# EAGLE design Platypus_v1_0_Proto_v14_0 (EAGLE 7.5.0)
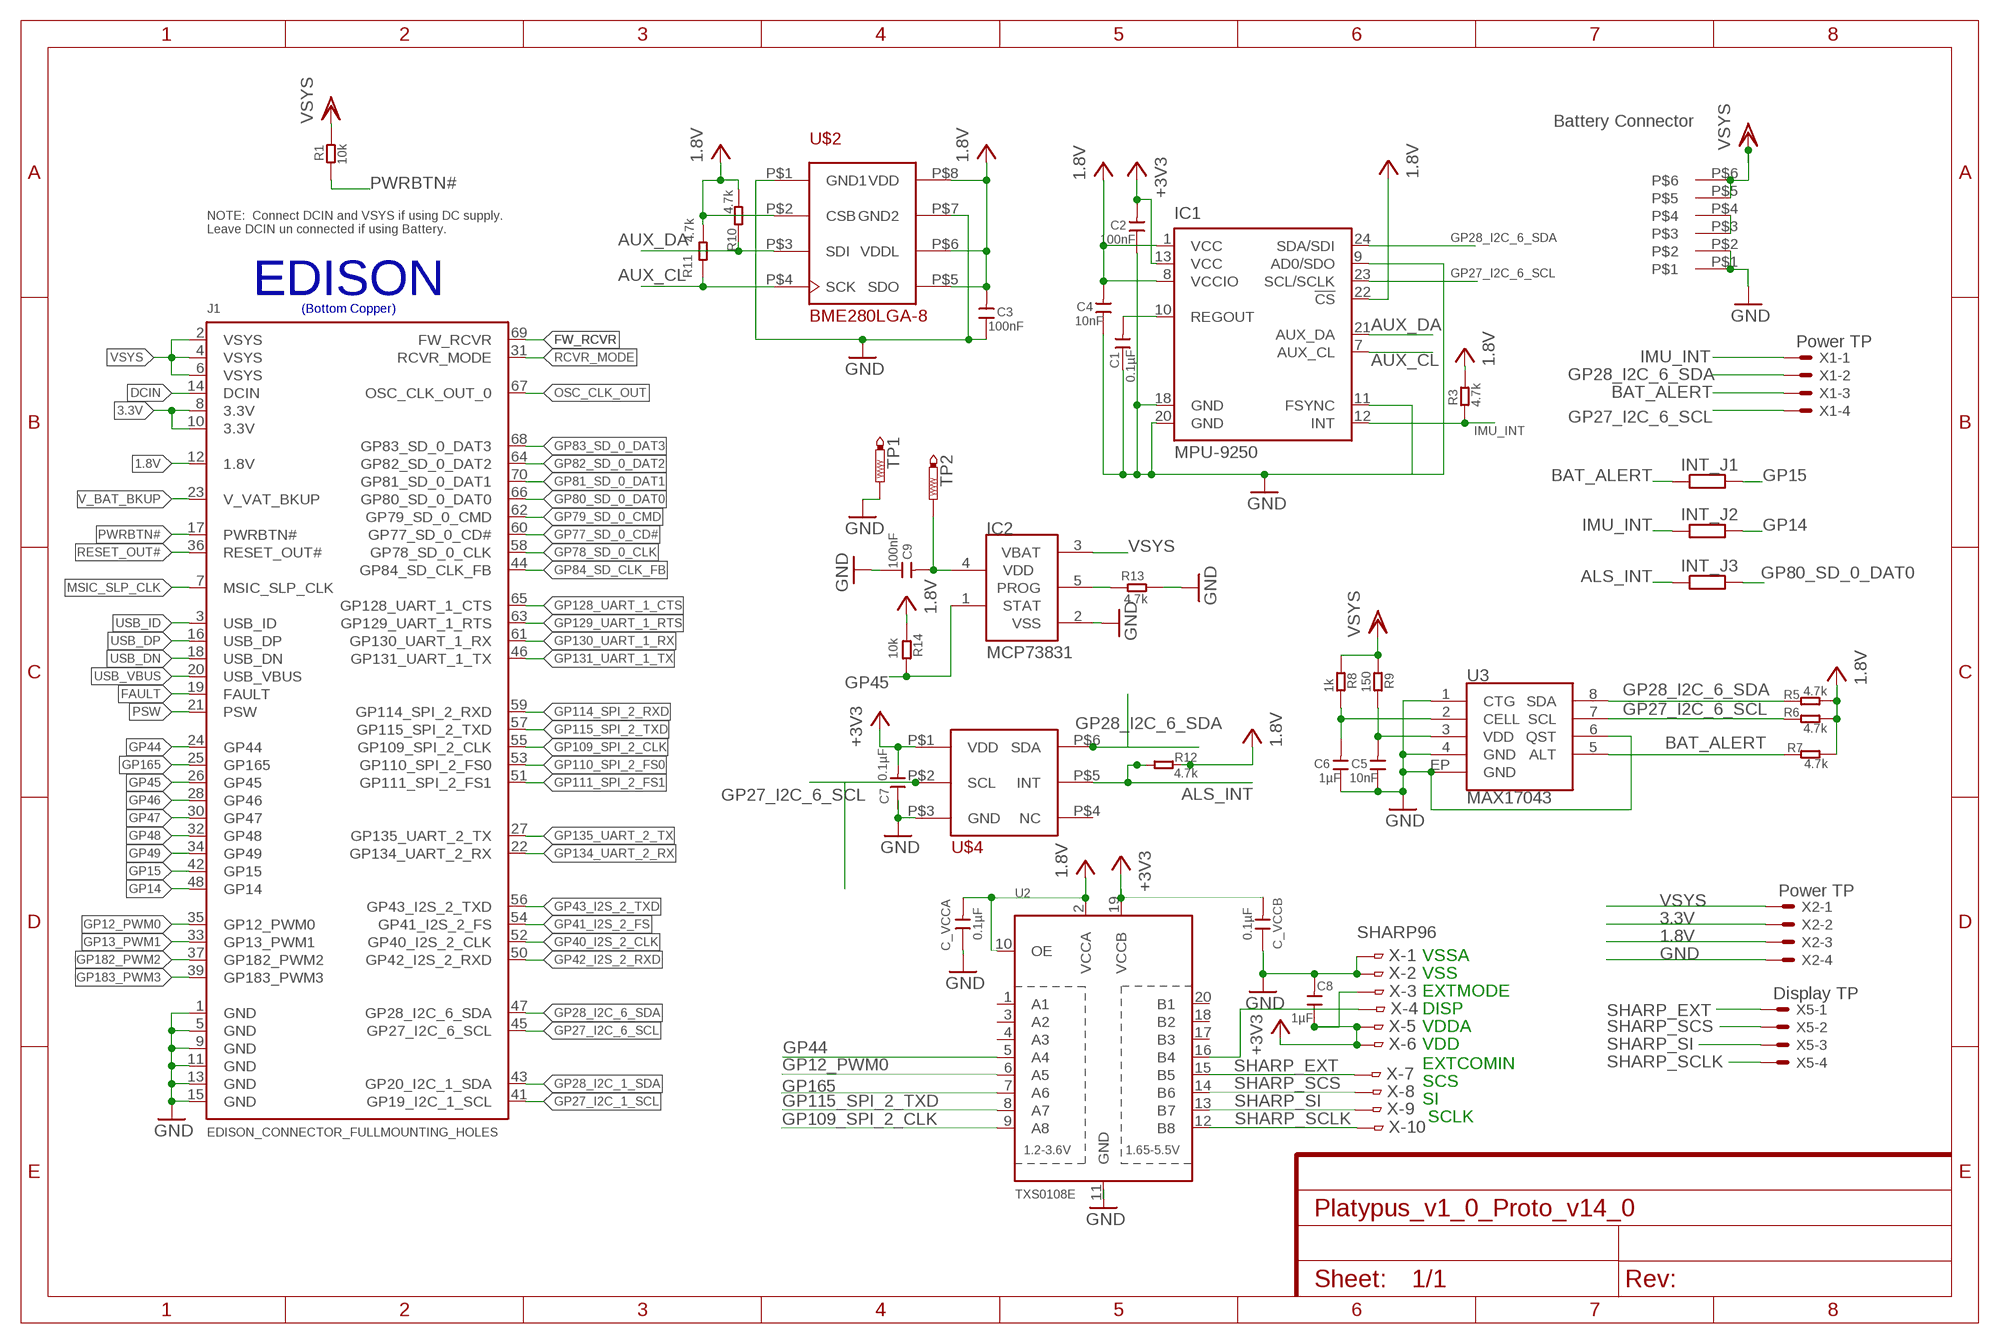
[diagram p0: schematic, sheet 1]

## Parts
C1  0.1µF  C-0603  [C0603]
C2  100nF  C-0603  [C0603]
C3  100nF  C-0603  [C0603]
C4  10nF  C-0603  [C0603]
C5  10nF  C-0603  [C0603]
C6  1µF  C-0603  [C0603]
C7  0.1µF  C-0603  [C0603]
C8  1µF  C-0603  [C0603]
C9  100nF  C-0603  [C0603]
C_VCCA  0.1µF  C-0603  [C0603]
C_VCCB  0.1µF  C-0603  [C0603]
IC1  MPU-9250  [QFN24-SMALL]
IC2  MCP73831  [SOT23-5L]
INT_J1  R-EU_R0201  [R0201]
INT_J2  R-EU_R0201  [R0201]
INT_J3  R-EU_R0201  [R0201]
J1  EDISON_CONNECTOR_FULLMOUNTING_HOLES  [EDISON_DAUGHTER]
R1  10k  R-0603  [R0603]
R3  4.7k  R-0603  [R0603]
R5  4.7k  R-0603  [R0603]
R6  4.7k  R-0603  [R0603]
R7  4.7k  R-0603  [R0603]
R8  1k  R-0603  [R0603]
R9  150  R-0603  [R0603]
R10  4.7k  R-0603  [R0603]
R11  4.7k  R-0603  [R0603]
R12  4.7k  R-0603  [R0603]
R13  4.7k  R-0603  [R0603]
R14  10k  R-0603  [R0603]
TP1  PTR1TP19SQ  [TP19SQ]
TP2  PTR1TP19SQ  [TP19SQ]
U2  TXS0108E  TXB0108PWR  [TSSOP20]
U3  MAX17043  MAX1704X  [TDFN-8]
U$2  BME280LGA-8  [LGA-8]
U$3  HIROSE_BAT_CON  [0.5MM-PITCH,6-PIN]
U$4  TSL25723FNFN-6PIN  [FN-6PIN]
X  SHARP96  FH12-10S-0.5SH  [FH12-10S-0.5SH]
X1  Power TP  53047-04  [53047-04]
X2  Power TP  53047-04  [53047-04]
X5  Display TP  53047-04  [53047-04]

## Nets
1.8V: C3.2 C4.2 C_VCCA.2 IC1.1(VCC) IC1.8(VCCIO) IC1.22(!CS) J1.12(1.8V) R3.2 R5.2 R6.2 R7.1 R10.2 R11.2 R12.2 R14.2 U2.2(VCCA) U2.10(OE) U$2.P$2(CSB) U$2.P$5(SDO) U$2.P$6(VDDL) U$2.P$8(VDD) X2.3
3.3V: C2.2 C7.2 C8.1 C_VCCB.2 IC1.13(VCC) J1.8(3.3V) J1.10(3.3V) U2.19(VCCB) U$4.P$1(VDD) X2.2 X.3 X.5 X.6 ; supply symbol labelled +3V3
ALS_INT: INT_J3.1 R12.1 U$4.P$5(INT)
AUX_CL: IC1.7(AUX_CL) R11.1 U$2.P$4(SCK)
AUX_DA: IC1.21(AUX_DA) R10.1 U$2.P$3(SDI)
BAT_ALERT: INT_J1.1 R7.2 U3.5(ALT) X1.3
DCIN: J1.14(DCIN)
FAULT: J1.19(FAULT)
FW_RCVR: J1.69(FW_RCVR)
GND: C1.1 C2.1 C3.1 C4.1 C5.1 C6.1 C7.1 C8.2 C9.1 C_VCCA.1 C_VCCB.1 IC1.9(AD0/SDO) IC1.11(FSYNC) IC1.18(GND) IC1.20(GND) IC2.2(VSS) J1.1(GND) J1.5(GND) J1.9(GND) J1.11(GND) J1.13(GND) J1.15(GND) R13.1 TP1.TP U2.11(GND) U3.1(CTG) U3.4(GND) U3.6(QST) U3.EP(GND) U$2.P$1(GND1) U$2.P$7(GND2) U$3.P$1 U$3.P$2 U$4.P$3(GND) X2.4 X.1 X.2
GP12_PWM0: J1.35(GP12_PWM0) U2.6(A5)
GP13_PWM1: J1.33(GP13_PWM1)
GP14: INT_J2.2 J1.48(GP14)
GP15: INT_J1.2 J1.42(GP15)
GP27_I2C_1_SCL: J1.41(GP19_I2C_1_SCL)
GP27_I2C_6_SCL: IC1.23(SCL/SCLK) J1.45(GP27_I2C_6_SCL) R6.1 U3.7(SCL) U$4.P$2(SCL) X1.4
GP28_I2C_1_SDA: J1.43(GP20_I2C_1_SDA)
GP28_I2C_6_SDA: IC1.24(SDA/SDI) J1.47(GP28_I2C_6_SDA) R5.1 U3.8(SDA) U$4.P$6(SDA) X1.2
GP40_I2S_2_CLK: J1.52(GP40_I2S_2_CLK)
GP41_I2S_2_FS: J1.54(GP41_I2S_2_FS)
GP42_I2S_2_RXD: J1.50(GP42_I2S_2_RXD)
GP43_I2S_2_TXD: J1.56(GP43_I2S_2_TXD)
GP44: J1.24(GP44) U2.5(A4)
GP45: IC2.1(STAT) J1.26(GP45) R14.1
GP46: J1.28(GP46)
GP47: J1.30(GP47)
GP48: J1.32(GP48)
GP49: J1.34(GP49)
GP77_SD_0_CD#: J1.60(GP77_SD_0_CD#)
GP78_SD_0_CLK: J1.58(GP78_SD_0_CLK)
GP79_SD_0_CMD: J1.62(GP79_SD_0_CMD)
GP80_SD_0_DAT0: INT_J3.2 J1.66(GP80_SD_0_DAT0)
GP81_SD_0_DAT1: J1.70(GP81_SD_0_DAT1)
GP82_SD_0_DAT2: J1.64(GP82_SD_0_DAT2)
GP83_SD_0_DAT3: J1.68(GP83_SD_0_DAT3)
GP84_SD_CLK_FB: J1.44(GP84_SD_CLK_FB)
GP109_SPI_2_CLK: J1.55(GP109_SPI_2_CLK) U2.9(A8)
GP110_SPI_2_FS0: J1.53(GP110_SPI_2_FS0)
GP111_SPI_2_FS1: J1.51(GP111_SPI_2_FS1)
GP114_SPI_2_RXD: J1.59(GP114_SPI_2_RXD)
GP115_SPI_2_TXD: J1.57(GP115_SPI_2_TXD) U2.8(A7)
GP128_UART_1_CTS: J1.65(GP128_UART_1_CTS)
GP129_UART_1_RTS: J1.63(GP129_UART_1_RTS)
GP130_UART_1_RX: J1.61(GP130_UART_1_RX)
GP131_UART_1_TX: J1.46(GP131_UART_1_TX)
GP134_UART_2_RX: J1.22(GP134_UART_2_RX)
GP135_UART_2_TX: J1.27(GP135_UART_2_TX)
GP165: J1.25(GP165) U2.7(A6)
GP182_PWM2: J1.37(GP182_PWM2)
GP183_PWM3: J1.39(GP183_PWM3)
IMU_INT: IC1.12(INT) INT_J2.1 R3.1 X1.1
MSIC_SLP_CLK: J1.7(MSIC_SLP_CLK)
N$2: IC2.5(PROG) R13.2
N$5: C1.2 IC1.10(REGOUT)
N$6: C6.2 R8.1 U3.2(CELL)
N$8: U2.16(B4) X.4
N$9: U$3.P$3 U$3.P$4
N$10: C9.2 IC2.4(VDD) TP2.TP
N$13: C5.2 R9.1 U3.3(VDD)
OSC_CLK_OUT: J1.67(OSC_CLK_OUT_0)
PSW: J1.21(PSW)
PWRBTN#: J1.17(PWRBTN#) R1.1
RCVR_MODE: J1.31(RCVR_MODE)
RESET_OUT#: J1.36(RESET_OUT#)
SHARP_EXT: U2.15(B5) X5.1 X.7
SHARP_SCLK: U2.12(B8) X5.4 X.10
SHARP_SCS: U2.14(B6) X5.2 X.8
SHARP_SI: U2.13(B7) X5.3 X.9
USB_DN: J1.18(USB_DN)
USB_DP: J1.16(USB_DP)
USB_ID: J1.3(USB_ID)
USB_VBUS: J1.20(USB_VBUS)
V_BAT_BKUP: J1.23(V_VAT_BKUP)
VSYS: IC2.3(VBAT) J1.2(VSYS) J1.4(VSYS) J1.6(VSYS) R1.2 R8.2 R9.2 U$3.P$5 U$3.P$6 X2.1
Unconnected: U2.1(A1) U2.3(A2) U2.4(A3) U2.17(B3) U2.18(B2) U2.20(B1) U$4.P$4(NC)

## Notes on the sheet
- Battery Connector
- NOTE:  Connect DCIN and VSYS if using DC supply.
  Leave DCIN un connected if using Battery.
- EDISON
- (Bottom Copper)
- VSSA
- VSS
- EXTMODE
- DISP
- VDDA
- VDD
- EXTCOMIN
- SCS
- SI
- SCLK

## Library data of the parts
C1-C9 C_VCCA C_VCCB = Discrete:C*: Ceramic Capacitors
IC1 = invensense:MPU-9250: 9-axis MotionTracking device communicate with I2C/SPI Source: http://www.invensense.com/mems/gyro/documents/PS-MPU-9250A-01.pdf
IC2 = microchip-update-2:MCP73831: Miniature Single-Cell, Fully Integrated Li-Ion, Li-Polymer Charge Management Controllers
INT_J1-INT_J3 = resistor:R-EU_: RESISTOR, European symbol
J1 = Edison:EDISON_CONNECTOR_FULL
R1 R3 R5-R14 = Discrete:R*
TP1 TP2 = testpad:PTR1: TEST PIN
U2 = adafruit:TXB0108PWR: 8-Bit Bi-Directional Level Shifter 1.2V-3.6V (VCCA) to 1.65V-5.5V (VCCB) bi-directional level shifter with auto direction sensing. Max data rate - VCCA 1.8V: 20Mbps (50ns), VCCA 3.3V: 100Mbps (10ns) Digikey: 296-21527-1-ND
U3 = SparkFun-PowerIC:MAX1704X: MAX17043/MAX17044: Battery Fuel Guage (43 is 1cell, 44 is 2cell); PROD-ID: IC-10399
U$2 = BME280:BME280
U$3 = Hirose_Bat_Con:HIROSE_BAT_CON
U$4 = TSL25723FN:TSL25723FN
X = con-hirose:FH12-10S-0.5S: 0.5mm Pitch Connectors For FPC/FFC Source: Data sheet <http://www.hirose.co.jp/cataloge_hp/e58605370.pdf>; MPN: FH12-10S-0.5SH(55); OC_FARNELL: 1324540; OC_NEWARK: 34M6152
X1 X2 X5 = con-molex:53?-04: CONNECTOR wire to board 1.25 mm (.049 inch) pitch header; MF: WALDOM/MOLEX; MPN: 53047-0410; OC_FARNELL: 9733060; OC_NEWARK: 38C9900

## Board
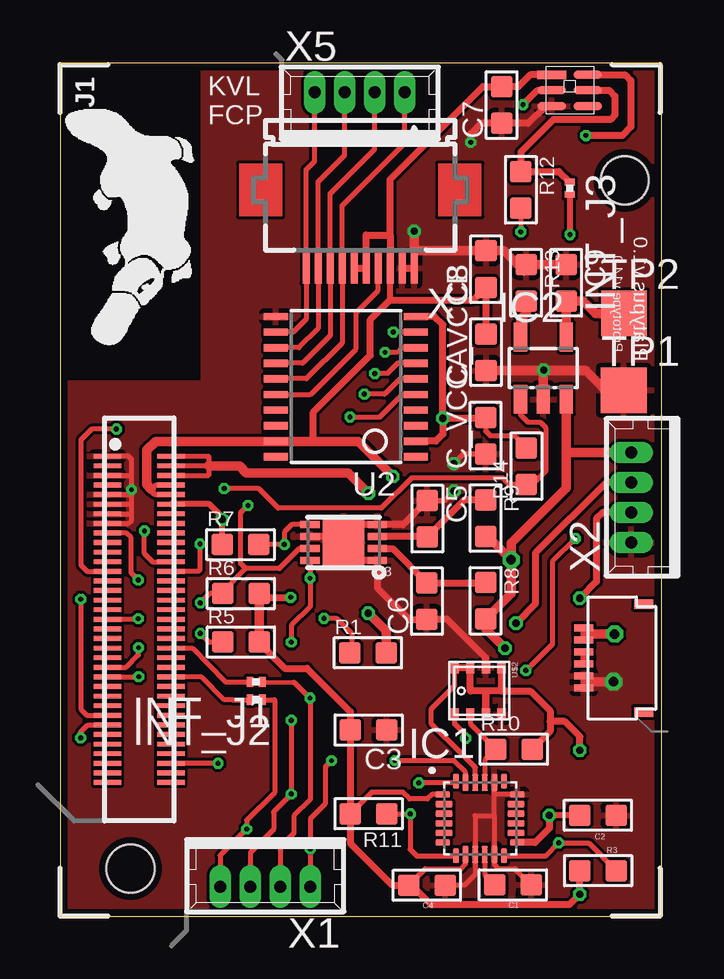
[diagram p1: board, top side]
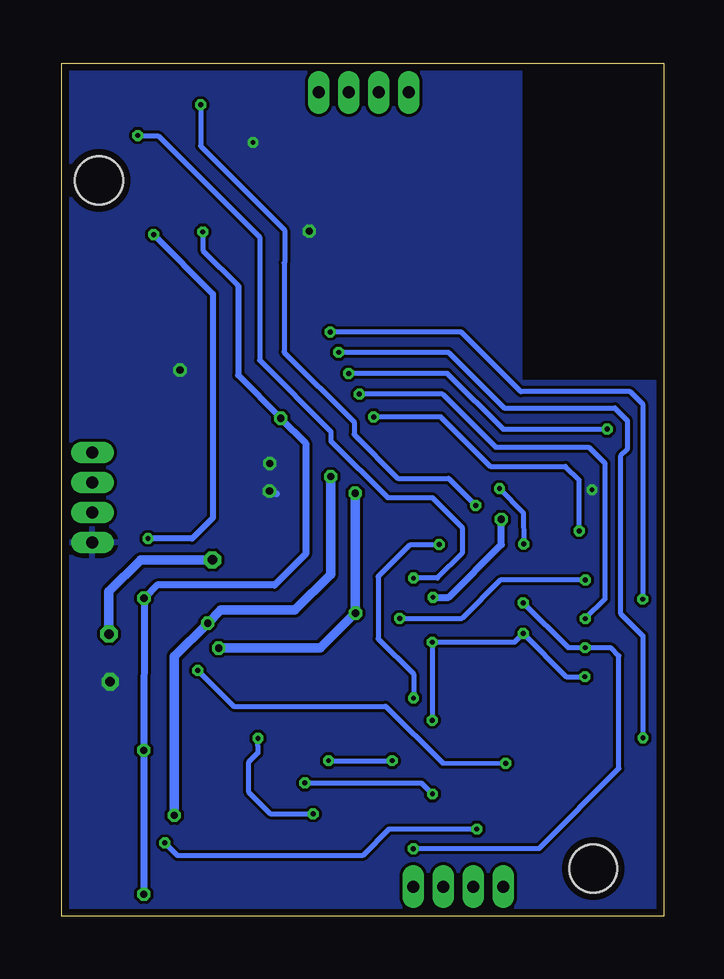
[diagram p2: board, bottom side, seen from below]

Size 25.07 x 35.55 mm. Coordinates in mm from the lower left corner, seen from the top.
Outline: 0,0 25.07,0 25.07,35.55 0,35.55 0,0
Copper layers (1*16): Top 0.035mm / dielectric 1.5mm / Bottom 0.035mm
Design rules "PCB-POOL HighSpec": minimum track width 0.125mm, minimum drill 0.2mm, track to track 0.125mm, track to pad 0.125mm, pad to pad 0.125mm, via to via 0.125mm, smd to smd 0.125mm, copper to edge 0.3mm, drill to drill 0.2mm, minimum pad ring 0.2mm, minimum via ring 0.125mm, stop-mask expansion 0.075mm, vias tented up to drill 0mil, thermal gap 0.2mm

### Footprints (pad centres in the part's own frame; a part is rotated, then mirrored left to right if it is on the bottom)
C0603 = smd 0.889 x 0.889: 1 -0.762,0; 2 0.762,0
QFN24-SMALL = smd 0.6 x 0.25: 1 -1.55,1; 6 -1.55,-1; 13 1.55,-1; 18 1.55,1 | smd 0.7 x 0.25: 2 -1.5,0.6; 3 -1.5,0.2; 4 -1.5,-0.2; 5 -1.5,-0.6; 14 1.5,-0.6; 15 1.5,-0.2; 16 1.5,0.2; 17 1.5,0.6 | smd 0.25 x 0.6: 7 -1,-1.55; 12 1,-1.55; 19 1,1.55; 24 -1,1.55 | smd 0.25 x 0.7: 8 -0.6,-1.5; 9 -0.2,-1.5; 10 0.2,-1.5; 11 0.6,-1.5; 20 0.6,1.5; 21 0.2,1.5; 22 -0.2,1.5; 23 -0.6,1.5
SOT23-5L = smd 0.55 x 1.2: 1 -0.95,-1.3; 2 0,-1.3; 3 0.95,-1.3; 4 0.95,1.3; 5 -0.95,1.3
R0201 = smd 0.28 x 0.43: 1 -0.255,0; 2 0.255,0
EDISON_DAUGHTER = smd 1.14 x 0.2: 1 1.98,19.17; 2 4.62,19.17; 3 1.98,18.77; 4 4.62,18.77; 5 1.98,18.37; 6 4.62,18.37; 7 1.98,17.97; 8 4.62,17.97; 9 1.98,17.57; 10 4.62,17.57; 11 1.98,17.17; 12 4.62,17.17; 13 1.98,16.77; 14 4.62,16.77; 15 1.98,16.37; 16 4.62,16.37; 17 1.98,15.97; 18 4.62,15.97; 19 1.98,15.57; 20 4.62,15.57; 21 1.98,15.17; 22 4.62,15.17; 23 1.98,14.77; 24 4.62,14.77; 25 1.98,14.37; 26 4.62,14.37; 27 1.98,13.97; 28 4.62,13.97; 29 1.98,13.57; 30 4.62,13.57; 31 1.98,13.17; 32 4.62,13.17; 33 1.98,12.77; 34 4.62,12.77; 35 1.98,12.37; 36 4.62,12.37; 37 1.98,11.97; 38 4.62,11.97; 39 1.98,11.57; 40 4.62,11.57; 41 1.98,11.17; 42 4.62,11.17; 43 1.98,10.77; 44 4.62,10.77; 45 1.98,10.37; 46 4.62,10.37; 47 1.98,9.97; 48 4.62,9.97; 49 1.98,9.57; 50 4.62,9.57; 51 1.98,9.17; 52 4.62,9.17; 53 1.98,8.77; 54 4.62,8.77; 55 1.98,8.37; 56 4.62,8.37; 57 1.98,7.97; 58 4.62,7.97; 59 1.98,7.57; 60 4.62,7.57; 61 1.98,7.17; 62 4.62,7.17; 63 1.98,6.77; 64 4.62,6.77; 65 1.98,6.37; 66 4.62,6.37; 67 1.98,5.97; 68 4.62,5.97; 69 1.98,5.57; 70 4.62,5.57 | hole 2: 23.53,30.67; 2.93,1.98
R0603 = smd 0.889 x 0.889: 1 -0.762,0; 2 0.762,0
TP19SQ = smd 1.9 x 1.9: TP 0,0
TSSOP20 = smd 0.305 x 0.991: 1 -2.925,-2.918; 2 -2.275,-2.918; 3 -1.625,-2.918; 4 -0.975,-2.918; 5 -0.325,-2.918; 6 0.325,-2.918; 7 0.975,-2.918; 8 1.625,-2.918; 9 2.275,-2.918; 10 2.925,-2.918; 11 2.925,2.918; 12 2.275,2.918; 13 1.625,2.918; 14 0.975,2.918; 15 0.325,2.918; 16 -0.325,2.918; 17 -0.975,2.918; 18 -1.625,2.918; 19 -2.275,2.918; 20 -2.925,2.918
TDFN-8 = smd 0.8 x 0.3: 1 -1.4,0.75; 2 -1.4,0.25; 3 -1.4,-0.25; 4 -1.4,-0.75; 5 1.4,-0.75; 6 1.4,-0.25; 7 1.4,0.25; 8 1.4,0.75 | smd 1.73 x 1.88: EP 0,0
LGA-8 = smd 0.5 x 0.35: P$1 0.975,0.975; P$2 0.975,0.325; P$3 0.975,-0.325; P$4 0.975,-0.975; P$5 -0.975,-0.975; P$6 -0.975,-0.325; P$7 -0.975,0.325; P$8 -0.975,0.975
0.5MM-PITCH,6-PIN = smd 0.3 x 0.8: P$1 0,0; P$2 0.5,0; P$3 1,0; P$4 1.5,0; P$5 2,0; P$6 2.5,0 | smd 0.4 x 0.8: P$7 -1,-2.5; P$8 3.5,-2.5
FN-6PIN = smd 1.2 x 0.35: P$1 0,0; P$2 0,-0.65; P$3 0,-1.3; P$4 1.5,-1.3; P$5 1.5,-0.65; P$6 1.5,0
FH12-10S-0.5SH = smd 0.3 x 1.3: 1 -2.25,3.25; 2 -1.75,3.25; 3 -1.25,3.25; 4 -0.75,3.25; 5 -0.25,3.25; 6 0.25,3.25; 7 0.75,3.25; 8 1.25,3.25; 9 1.75,3.25; 10 2.25,3.25
53047-04 = drill 0.5 pad 0.698 long: 1 1.875,0.45; 2 0.625,0.45; 3 -0.625,0.45; 4 -1.875,0.45

### Placement (x,y rotation side)
C1  18.87,1.3 180 top
C2  22.41,4.21 180 top
C3  12.86,7.76 180 top
C4  15.29,1.29 180 top
C5  15.31,16.57 270 top
C6  15.29,13.13 90 top
C7  18.4,33.81 90 top
C8  17.75,26.97 90 top
C9  21.09,26.4 270 top
C_VCCA  17.73,20.03 90 top
C_VCCB  17.75,23.51 90 top
IC1  17.5,4.07 0 top
IC2  20.14,22.84 0 top
INT_J1  8.17,9.76 180 top
INT_J2  8.17,9.02 180 top
INT_J3  21.24,30.34 270 top
J1  0,0 0 top
R1  12.83,10.98 0 top
R3  22.42,1.89 180 top
R5  7.54,11.42 0 top
R6  7.54,13.45 0 top
R7  7.52,15.49 0 top
R8  17.73,13.14 270 top
R9  17.73,16.59 270 top
R10  18.91,6.96 0 top
R11  12.86,4.27 180 top
R12  19.2,30.28 270 top
R13  19.42,26.4 270 top
R14  19.43,18.76 90 top
TP1  23.49,21.92 0 top
TP2  23.5,25.13 0 top
U2  11.91,22.07 90 top
U3  11.82,15.57 180 top
U$2  17.42,9.39 270 top
U$3  21.82,9.51 90 top
U$4  20.49,35.07 0 top
X  12.51,30.27 180 top
X1  8.55,1.68 180 top
X2  24.25,17.46 90 top
X5  12.49,33.89 0 top

### Tracks (layer width: path | path; a pad name or v marks a point on that pad's centre or on a via)
1.8V  (via drill 0.2, 0.3)
  Top 0.2: 17.69,20.75 C_VCCA.2 17.73,20.22 17.92,20.03 18.92,20.03 R14.2 | C4.2 15.22,1.98 16.71,1.98 16.9,2.17 IC1.8 | IC1.22 17.31,6.19 16.68,6.82 15.47,8.02 15.47,8.64 16.44,9.61 U$2.P$5 | IC1.1 15.5,5.07 15.31,4.88 14.57,4.88 14.29,5.16 12.99,5.16 R11.2 | R12.2 v19.2,28.52
  Top 0.24: 6.22,17.17 J1.12
  Top 0.25: R7.1 6.76,16.63
  Top 0.254: 6.22,17.17 6.76,16.63 v6.76,16.54
  Top 0.3: v15.95,20.75 v15.95,20.74 v15.96,20.75 17.69,20.75 | v15.95,20.75 15.95,24.65 15.6,25 U2.10 | v15.95,20.75 15.95,20.09 15.66,19.8 U2.2 | R3.2 v21.66,0.91 v21.65,0.91 21.23,0.49 15.44,0.49 14.59,1.34 C4.2 13.85,1.29 12.1,3.04 R11.2 C3.2 12.1,8.52 10.29,10.33 9.36,10.33 8.3,11.39 8.29,11.39 8.29,13.29 8.31,13.29 | 6.76,16.63 v6.76,16.54 | R6.2 8.31,13.29 | 8.3,11.37 R5.2 | 18.41,10.37 U$2.P$8 18.39,9.38 | U$2.P$5 U$2.P$6 17.1,9.38 17.74,9.38 | 8.3,11.41 R5.2 | 8.3,11.4 R5.2 | 8.31,13.29 v9.61,13.29 | R10.2 20.42,7.71 20.42,8.11 | 17.75,9.38 17.74,9.38 | 18.39,9.38 17.75,9.38 | 17.75,9.38 U$2.P$2 17.74,9.38 | 18.39,9.38 19.58,9.38 20.42,8.55 20.42,8.11 | v21.66,6.91 21.66,7.49 21.04,8.11 20.42,8.11 | X2.3 22.61,16.84 22.35,16.57 22.35,13.95 v21.65,13.25
  Top 0.4: R6.2 R5.2 | R7.1
  Bottom 0.2: v19.2,28.52 19.2,27.75 17.73,26.28
  Bottom 0.254: 17.73,26.28 17.73,22.55 15.95,20.77 v15.95,20.75
  Bottom 0.3: v21.66,0.91 21.66,4.89 v21.66,6.91 v21.65,13.25 21.1,13.8 16.21,13.8 14.92,15.09 14.92,19.72 v15.95,20.75 | v9.61,13.29 8.96,13.29 R7.1 6.76,16.63 v6.76,16.54
3.3V  (via drill 0.3)
  Top 0.2: J1.10 4.03,17.57 arc-90 3.81,17.79 3.99,17.97 J1.8
  Top 0.25: C2.2 21.64,4.2 v20.39,4.2
  Top 0.254: X.3 13.74,27.02 13.74,25.68
  Top 0.3: U2.19 | X.6 X.5 12.76,28.39 13.76,28.39 | v20.39,4.2 20.39,3.66 19.8,3.07 IC1.13 | 10.56,19.79 10.56,21.01 12.93,23.38 12.93,24.87 13.74,25.68 17.22,25.68 C8.1 C_VCCB.2 | 13.76,28.39 X.3 | 13.76,28.39 13.76,30.72 17.62,34.58 C7.2 19.09,34.57 19.59,35.07 U$4.P$1 | X2.2 22.77,18.09 19.81,15.13 19.81,13.02 v19,12.21
  Top 0.4: v13.87,18.32 13.87,18.34 12.42,19.79 10.56,19.79 U2.19 3.98,19.79 3.61,19.42 3.61,17.99 3.81,17.79
  Bottom 0.254: 18.98,12.2 v18.99,12.2 v19,12.21
  Bottom 0.4: v20.39,4.2 20.39,10.82 v19,12.21 18.45,12.76 15.36,12.76 13.87,14.25 v13.87,18.32
ALS_INT
  Top 0.3: U$4.P$5 22.89,34.42 23.12,34.19 23.12,33.39 22.94,33.21 20.56,33.21 19.2,31.85 R12.1 20.79,31.04 INT_J3.1
AUX_CL  (via drill 0.2)
  Top 0.2: IC1.7 14.86,2.51 14.59,2.78 v14.6,4.26 R11.1 | v16.9,7.41 16.9,7.55 16.44,8.01 U$2.P$4
  Bottom 0.2: v16.9,7.41 16.91,7.09 16.91,6.8 17.3,6.4 17.3,5.19 16.38,4.27 v14.6,4.26
AUX_DA
  Top 0.2: U$2.P$3 17.09,8.01 R10.1 17.7,6.51 IC1.21
BAT_ALERT  (via drill 0.2)
  Top 0.2: R7.2 v9.35,15.49 9.35,16.01 9.66,16.32 U3.5 | INT_J1.1 9.76,9.75 v10.42,9.08 | v10.42,9.09 v10.42,9.08 | v10.42,9.08 10.42,4.85 9.74,4.17 9.74,3.46 9.17,2.89 9.17,1.16 X1.3
  Bottom 0.2: v9.35,15.49 10.55,15.49 11.89,14.15 11.89,11.56 10.42,10.09 v10.42,9.09
GND  (via drill 0.2, 0.3, 0.4)
  Top 0.2: X.1 14.76,27.73 | C4.1 16.85,1.29 17.3,1.74 IC1.9 17.3,4.18 18.1,4.18 | C1.1 18.95,1.98 18.27,1.98 18.1,2.15 IC1.11 18.1,4.18 | 18.1,4.18 18.1,5.06 | 18.1,5.06 IC1.20 | IC1.18 18.11,5.07 18.1,5.06 | 8.97,24.98 U2.11 | J1.15 2.85,16.37 2.98,16.5 2.98,16.77 | 2.98,17.13 2.98,17.54 | 2.98,17.54 v2.98,17.77 2.98,18.38 | 2.98,18.38 2.98,19.04 2.85,19.17 J1.1 | J1.5 2.97,18.37 2.98,18.38 | J1.9 2.95,17.57 2.98,17.54 | J1.11 2.94,17.17 2.98,17.13 | J1.13 2.98,16.77 | 2.98,16.77 2.98,17.13 | R13.1 19.35,27.09 19.35,26.88 | C_VCCA.1 16.81,19.27 v16.41,18.87 | C5.1 16.03,17.33 v16.42,17.72
  Top 0.3: 12.57,16.32 U3.4 14.3,16.32 C5.1 | 12.26,14.82 U3.1 13.22,13.68 14.55,12.36 C6.1 | 11.57,15.82 U3.6 | X.2 X.1 | U$2.P$7 17.75,10.75 16.13,12.37 C6.1 | U$3.P$2 U$3.P$1 21.9,9.77 | v17.11,32.25 17.11,32.6 17.56,33.05 C7.1 19.51,33.05 20.23,33.77 U$4.P$3
  Top 0.4: v14.76,28.55 14.76,27.73 C8.2 18.5,27.73 19.35,26.88 | 21.9,9.77 v23.06,9.77 | C_VCCB.1 20.15,22.75 | 20.15,22.75 21.9,22.75 22.62,22.03 TP1.TP | IC2.2 20.14,22.74 20.15,22.75 | 20.15,22.75 v20.15,22.76 | C9.1 R13.1
  Top 0.406: 12.57,16.32 arc90 U3.EP | 12.26,14.82 arc-90 12.21,14.87 12.21,15.18 arc90 U3.EP | U3.EP 11.57,15.82 | C6.1
  Bottom 0.3: v16.42,17.72 16.13,17.6
  Bottom 0.4: v20.15,22.76 v20.15,22.77
  pour Bottom: 5.99,35.44 24.97,35.44 24.97,0.14 0.1,0.14 0.1,22.25 5.97,22.25 5.97,35.43
  pour Top: 7.85,35.44 24.97,35.44 24.97,0.99 24.97,0.14 0.94,0.14 0.1,0.14 0.1,21.45 0.1,22.25 3.81,22.25 5.97,22.25 5.97,34.28 5.97,35.44 7.65,35.44
GP12_PWM0  (via drill 0.2)
  Top 0.2: U2.6 14.17,22.4 13.53,21.76 v12.68,21.76 | J1.35 3.23,12.37 v3.26,12.4
  Bottom 0.2: v12.68,21.76 9.21,21.76 7,19.55 3.12,19.55 2.45,18.88 2.45,13.21 v3.26,12.4
GP14
  Top 0.2: J1.48 5.9,9.97 6.85,9.02 7.18,9.02 7.17,9.02 INT_J2.2
GP15
  Top 0.2: INT_J1.2 6.89,9.77 5.51,11.17 J1.42
GP27_I2C_6_SCL  (via drill 0.2)
  Top 0.2: 3.27,11.04 v3.27,11.19 3.27,10.88 2.76,10.37 J1.45 | U3.7 9.97,15.32 9.14,14.49 7.75,14.49 | 7.75,14.49 7.52,14.72 7.52,16.81 v7.83,17.12 | 7.75,14.49 6.78,13.52 R6.1 6.24,13.45 v5.85,13.06 | X1.4 10.43,1.16 v10.43,2.81 10.43,4.05 11.06,4.68 11.06,6.23 v11.31,6.48 | IC1.23 16.9,5.99 16.41,6.48 v13.96,6.48
  Top 0.3: U$4.P$2 19.87,34.4 v19.29,33.82
  Bottom 0.2: v10.43,2.81 5.2,2.81 1.86,6.15 1.86,10.85 2.18,11.17 3.25,11.17 v3.27,11.19 3.98,11.19 v5.85,13.06 | v13.96,6.48 v11.31,6.48 | v7.83,17.12 8.96,18.25 11.07,18.25 12.9,20.08 12.9,20.6 15.82,23.52 15.81,23.53 15.81,27.23 15.79,27.25 15.79,28.59 19.29,32.1 v19.29,33.82
GP28_I2C_6_SDA  (via drill 0.2)
  Top 0.2: v5.85,11.78 6.21,11.42 R5.1 | U3.8 v10.42,14.09 10.42,12.89 9.64,12.11 v9.64,11.42 | X1.2 7.93,1.16 7.93,2.64 8.9,3.61 8.9,4.34 v9.64,5.08 | IC1.24 16.43,5.55 v14.95,5.55 | v9.64,8.16 v9.64,5.08 | v9.63,5.09 v9.64,5.08 | J1.47 3.3,9.97 v3.28,9.98
  Top 0.3: U$4.P$6 23.55,35.07 23.79,34.83 23.79,32.9 23.43,32.54 v21.91,32.54
  Bottom 0.2: v9.64,8.16 v9.64,11.42 6.21,11.42 v5.85,11.78 4.05,9.98 v3.28,9.98 | v10.42,14.09 9.43,14.09 8.4,15.12 8.4,16.21 9.63,17.44 11.5,17.44 13.86,19.8 13.86,20.2 16.83,23.17 16.83,28.3 21.06,32.53 v21.92,32.53 v21.91,32.54 | v14.95,5.55 10.09,5.55 v9.63,5.09
GP44  (via drill 0.2)
  Top 0.2: J1.24 3.86,14.77 3.52,15.11 v3.52,16.06 | v12.08,20.81 13.33,20.81 14.27,21.75 U2.5
  Bottom 0.2: v3.52,16.06 3.52,18.18 4.09,18.75 7.22,18.75 9.28,20.81 v12.08,20.81 v12.07,20.8
GP45  (via drill 0.2)
  Top 0.2: 19.54,18.22 R14.1 | R14.1 19.68,18 20.23,18.55 20.23,20.37 20.01,20.59 19.49,20.59 19.19,20.89 IC2.1 | R14.1 18.72,18 18.45,18.27 14.65,18.27 13.39,17.01 9.09,17.01 8.28,17.82 v6.84,17.82 | v5.83,15.51 5.83,14.43 5.78,14.37 J1.26
  Bottom 0.2: v6.84,17.82 5.84,16.8 v5.83,15.51
GP80_SD_0_DAT0  (via drill 0.2)
  Top 0.2: v6.58,6.37 J1.66 | v21.48,15.74 20.52,14.78 20.52,11.33 19.43,10.24 v19.41,10.24
  Top 0.254: INT_J3.2 21.24,28.39 v21.25,28.41
  Bottom 0.2: v6.58,6.37 9.21,6.38 11.58,8.75 17.92,8.75 v19.41,10.24
  Bottom 0.254: v21.48,15.74 19.64,15.74 18.78,16.6 18.78,25.93 v21.25,28.41
GP109_SPI_2_CLK  (via drill 0.2)
  Top 0.2: v0.87,13.21 0.87,8.62 1.12,8.37 J1.55 | U2.9 v13.89,24.35
  Bottom 0.2: 0.87,13.15 v0.87,13.21 0.87,21.35 1.38,21.86 5.95,21.86 8.44,24.35 v13.89,24.35
GP115_SPI_2_TXD  (via drill 0.2)
  Top 0.2: v0.86,7.43 0.86,7.67 1.16,7.97 J1.57 | U2.8 14.25,23.7 14.05,23.5 v13.54,23.5
  Bottom 0.2: v0.86,7.43 0.86,11.68 1.8,12.62 1.8,19.17 1.52,19.45 1.52,20.69 1.53,20.69 2.03,21.19 6.65,21.19 8.96,23.5 v13.54,23.5
GP165  (via drill 0.2)
  Top 0.2: v2.35,20.3 1.32,20.3 0.87,19.85 0.87,14.63 1.13,14.37 J1.25 | U2.7 14.06,23.05 13.64,22.62 v13.12,22.62
  Bottom 0.2: v2.34,20.29 v2.35,20.3 6.69,20.3 9.01,22.62 v13.12,22.62
IMU_INT  (via drill 0.2)
  Top 0.2: INT_J2.1 8.94,9.02 8.94,5.14 7.78,4 v7.78,3.63 6.67,2.53 X1.1 | R3.1 22.02,3.05 v20.78,3.05 20.25,2.52 IC1.12
  Bottom 0.2: v7.78,3.63 11.43,3.63 12.54,2.52 20.25,2.52 v20.78,3.05
N$2
  Top 0.4: R13.2 19.42,25.13 19.19,24.9 IC2.5
N$5
  Top 0.2: IC1.10 17.7,1.71 C1.2
N$6
  Top 0.3: 17.68,13.89 C6.2 13.86,15.32 U3.2
  Top 0.406: 17.68,13.89 R8.1
N$8
  Top 0.2: U2.16 10.44,21.74 12.34,23.64 12.34,25.16 13.26,26.08 X.4
N$9
  Top 0.3: U$3.P$4 U$3.P$3
N$10
  Top 0.2: 23.48,25.11 TP2.TP
  Top 0.4: 23.62,25.7 TP2.TP | IC2.4 C9.2 21.79,25.64 22.32,25.11 23.48,25.11
N$13
  Top 0.3: 15.3,15.82 U3.3 | R9.1 16.85,17.35 C5.2
  Top 0.406: C5.2 15.3,15.82
PWRBTN#  (via drill 0.2)
  Top 0.2: R1.1 12.17,11.24 12.17,11.76 11.53,12.4 v11.01,12.4 v11,12.41 | J1.17 2.77,15.97 2.96,15.78 2.96,14.31 v3.26,14.01
  Bottom 0.2: v11,12.41 8.4,12.41 6.8,14.01 v3.26,14.01
SHARP_EXT
  Top 0.2: U2.15 10.27,22.4 11.76,23.89 X.7 11.76,29.62 14.37,32.23 X5.1
SHARP_SCLK
  Top 0.2: X5.4 10.61,34.4 10.61,31.47 10.26,31.12 X.10 10.26,24.88 10.25,24.88 9.71,24.34 U2.12
SHARP_SCS
  Top 0.2: U2.14 10.11,23.05 11.26,24.2 X.8 11.26,30.12 13.11,31.97 X5.2
SHARP_SI
  Top 0.2: U2.13 9.95,23.7 10.75,24.5 10.76,24.5 X.9 10.76,30.62 11.86,31.72 X5.3
VSYS  (via drill 0.3, 0.4)
  Top 0.2: 6.21,18.77 J1.4 | J1.2 6.19,19.17 6.19,18.79 6.19,18.37 J1.6
  Top 0.3: U$3.P$6 U$3.P$5 21.9,11.76
  Top 0.4: v18.54,11.17 17.73,11.98 R8.2 18.8,13.45 v18.8,14.85 | R1.2 13.59,11.88 v12.84,12.63 | R9.2 17.82,15.83 v18.8,14.85 | v23.11,11.76 21.9,11.76 | 18.8,14.96 v18.8,14.85 | 18.8,15.31 v18.8,14.85 | v18.8,14.85 18.8,15.56 21.09,17.85 21.09,19.34 | IC2.3 21.09,19.34 | X2.1 21.09,19.34 | 6.19,18.79 6.21,18.77 7.48,18.77 7.77,18.48 12,18.48 v12.85,17.63
  Top 0.406: R8.2
  Bottom 0.4: v18.54,11.17 14.3,11.17 v12.84,12.63 v12.84,17.63 v12.85,17.63 | v18.8,14.85 21.79,14.85 23.11,13.53 v23.11,11.76

### Text on the board
tDocu: Display Test Point | TSL25723FN | SHARP_SCK | SHARP_SI | SHARP_SCS | SHARP_EXT | Ambient Light Sensor(ALS) | C7 0.1µF | J_ALS | R12 4k7 | SHARP / Display / Connector | Antenna KOZ | TXS0108E | C8 1µF | C_VCCB / 0.1µF | MCP73832 / Battery Charger | Power TP | Level / / Shifter | VSYS | C_VCCA / 0.1µF | 3V3 | 1V8 | R7 4k7 | MAX / 17043 | C5 10nF | R9 150 | GND | R6 4k7 | Battery / Gauge | C6 1µF | R5 4k7 | R8 1k | VSYS | R1 10k | TEMP | J_IMU | J_BAT | GND | Pressure / Humidity / Temperature / Sensor | BME / 280 | C3 0.1µF | R10 4k7 | Power / Connector | Intel Edison 70-pin Hirose Connector | R11 4k7 | MPU / 9255 | C2 0.1µF | 9DOF / IMU | C4 10nF | C1 0.1µF | R3 4k7 | IMU_INT | I2C_1_SDA | BAT_INT | I2C_1_SCL | I2C Test Point
tSilk: KVL / FCP | Platypus v1.0
_tsilk: Prototype v14.0